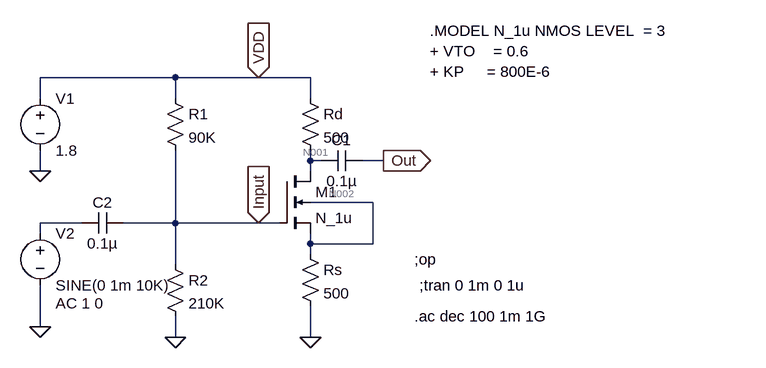
[diagram p0: schematic ass_1_ques_4.asc]
ass_1_ques_4.asc, the LTspice schematic file:
Version 4
SHEET 1 1244 680
WIRE 0 -32 -208 -32
WIRE 128 -32 0 -32
WIRE 208 -32 128 -32
WIRE -208 0 -208 -32
WIRE 0 0 0 -32
WIRE 208 0 208 -32
WIRE 208 96 208 80
WIRE 224 96 208 96
WIRE 320 96 288 96
WIRE -208 112 -208 80
WIRE 208 112 208 96
WIRE 304 160 208 160
WIRE -144 192 -208 192
WIRE 0 192 0 80
WIRE 0 192 -80 192
WIRE 128 192 0 192
WIRE 160 192 128 192
WIRE -208 208 -208 192
WIRE 208 224 208 208
WIRE 304 224 304 160
WIRE 304 224 208 224
WIRE 208 240 208 224
WIRE 0 256 0 192
WIRE -208 352 -208 288
WIRE 0 368 0 336
WIRE 208 368 208 320
FLAG 208 368 0
FLAG 0 368 0
FLAG -208 352 0
FLAG -208 112 0
FLAG 320 96 Out
IOPIN 320 96 Out
FLAG 128 192 Input
IOPIN 128 192 In
FLAG 128 -32 VDD
IOPIN 128 -32 In
SYMBOL nmos4 160 112 R0
SYMATTR InstName M1
SYMATTR Value N_1u
SYMATTR Value2 l=1u w=20u
SYMBOL res 192 -16 R0
SYMATTR InstName Rd
SYMATTR Value 500
SYMBOL res 192 224 R0
SYMATTR InstName Rs
SYMATTR Value 500
SYMBOL res -16 -16 R0
SYMATTR InstName R1
SYMATTR Value 90K
SYMBOL res -16 240 R0
SYMATTR InstName R2
SYMATTR Value 210K
SYMBOL voltage -208 -16 R0
WINDOW 123 0 0 Left 0
WINDOW 39 0 0 Left 0
SYMATTR InstName V1
SYMATTR Value 1.8
SYMBOL voltage -208 192 R0
WINDOW 123 24 124 Left 2
WINDOW 39 0 0 Left 0
SYMATTR Value2 AC 1 0
SYMATTR InstName V2
SYMATTR Value SINE(0 1m 10K)
SYMBOL cap 288 80 R90
WINDOW 0 0 32 VBottom 2
WINDOW 3 32 32 VTop 2
SYMATTR InstName C1
SYMATTR Value 0.1µ
SYMBOL cap -80 176 R90
WINDOW 0 0 32 VBottom 2
WINDOW 3 32 32 VTop 2
SYMATTR InstName C2
SYMATTR Value 0.1µ
TEXT 392 -104 Left 2 !.MODEL N_1u NMOS LEVEL  = 3                  \n+ VTO    = 0.6      \n+ KP     = 800E-6
TEXT 368 248 Left 2 !;op
TEXT 376 288 Left 2 !;tran 0 1m 0 1u
TEXT 368 336 Left 2 !.ac dec 100 1m 1G

The netlist it stands for:
* ass_1_ques_4.asc
M1 N001 Input N002 N002 N_1u l=1u w=20u
Rd VDD N001 500
Rs N002 0 500
R1 VDD Input 90K
R2 Input 0 210K
V1 VDD 0 1.8
V2 N003 0 SINE(0 1m 10K) AC 1 0
C1 Out N001 0.1µ
C2 Input N003 0.1µ
.model NMOS NMOS
.model PMOS PMOS
.lib standard.mos
.MODEL N_1u NMOS LEVEL  = 3
+ VTO    = 0.6
+ KP     = 800E-6
;op
;tran 0 1m 0 1u
.ac dec 100 1m 1G
.backanno
.end

* Results of the author's LTspice run, read from the files saved beside the schematic
* Operating Point, zero values left out:
*   V(n001) = 1.44 V
*   V(input) = 1.26 V
*   V(n002) = 360 mV
*   V(vdd) = 1.8 V
*   V(out) = 144 nV
*   Id(M1) = 720 µA
*   Ib(M1) = -1.09 pA
*   Is(M1) = -720 µA
*   I(R2) = 6 µA
*   I(R1) = 6 µA
*   I(Rs) = 720 µA
*   I(Rd) = 720 µA
*   I(V1) = -726 µA
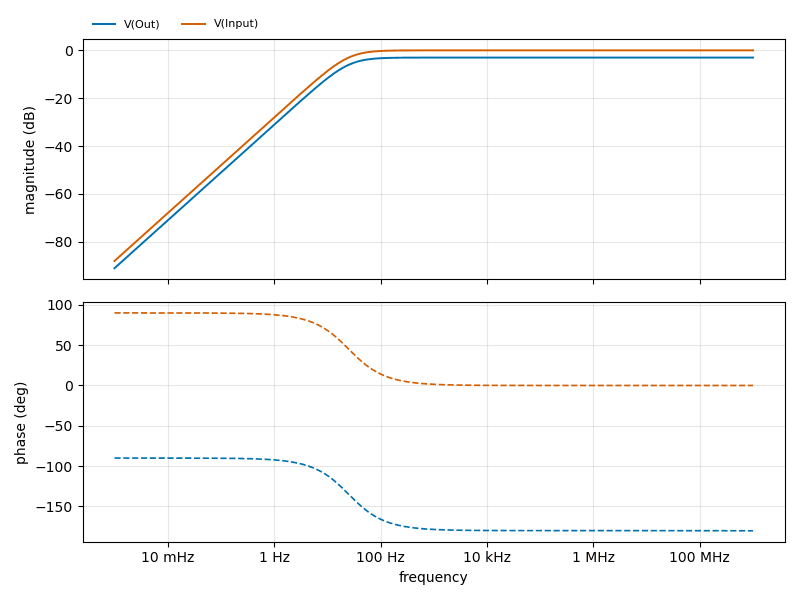
[diagram p1: AC Analysis of ass_1_ques_4.asc, plotted from the saved traces]
* AC Analysis, 1 run:
*   V(Out): -91.07 dB at 1 mHz, -3.03 dB at 1 GHz, peak -3.03 dB at 2.399 MHz, 3 dB below the peak at 25.26 Hz
*   V(Input): -88.05 dB at 1 mHz, -0.00 dB at 1 GHz, peak -0.00 dB at 1 GHz, 3 dB below the peak at 25.26 Hz